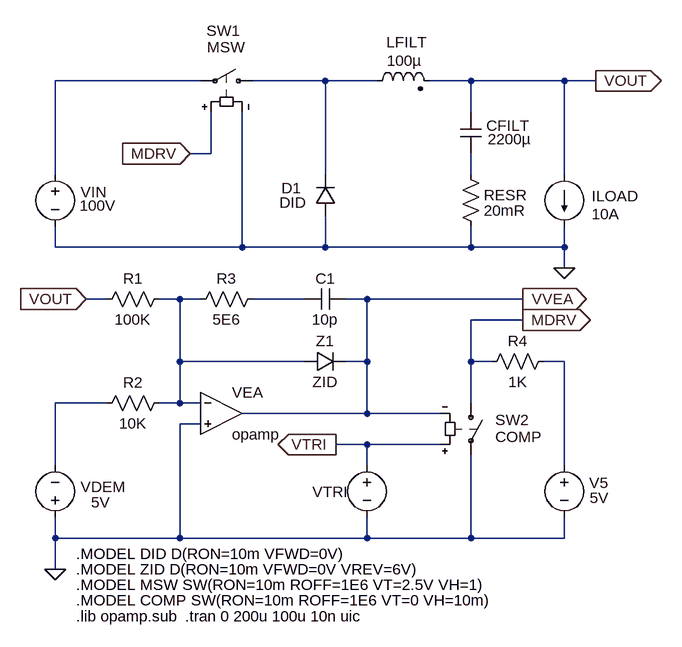
[diagram p0: schematic voltmodea[1].asc]
voltmodea[1].asc, the LTspice schematic file:
Version 4
SHEET 1 880 1136
WIRE -192 224 -416 224
WIRE 0 224 -112 224
WIRE 80 224 0 224
WIRE 224 224 160 224
WIRE 368 224 224 224
WIRE 416 224 368 224
WIRE 224 272 224 224
WIRE -176 336 -176 272
WIRE -176 336 -208 336
WIRE -416 368 -416 224
WIRE 0 368 0 224
WIRE 224 368 224 336
WIRE 368 368 368 224
WIRE -416 480 -416 448
WIRE -128 480 -128 272
WIRE -128 480 -416 480
WIRE 0 480 0 432
WIRE 0 480 -128 480
WIRE 224 480 224 448
WIRE 224 480 0 480
WIRE 368 480 368 448
WIRE 368 480 224 480
WIRE 368 512 368 480
WIRE -336 560 -368 560
WIRE -224 560 -256 560
WIRE -192 560 -224 560
WIRE -32 560 -112 560
WIRE 64 560 32 560
WIRE 304 560 64 560
WIRE 304 592 224 592
WIRE -224 656 -224 560
WIRE -32 656 -224 656
WIRE 64 656 64 560
WIRE 64 656 32 656
WIRE 224 656 224 592
WIRE 256 656 224 656
WIRE 368 656 336 656
WIRE -336 720 -416 720
WIRE -224 720 -224 656
WIRE -224 720 -256 720
WIRE -192 720 -224 720
WIRE 224 720 224 656
WIRE 64 736 64 656
WIRE 64 736 -128 736
WIRE 176 736 64 736
WIRE -192 752 -224 752
WIRE 64 784 16 784
WIRE 176 784 64 784
WIRE -416 816 -416 720
WIRE 64 816 64 784
WIRE 368 816 368 656
WIRE -416 928 -416 896
WIRE -224 928 -224 752
WIRE -224 928 -416 928
WIRE 64 928 64 896
WIRE 64 928 -224 928
WIRE 224 928 224 800
WIRE 224 928 64 928
WIRE 368 928 368 896
WIRE 368 928 224 928
WIRE -416 976 -416 928
FLAG -208 336 MDRV
IOPIN -208 336 In
FLAG 368 512 0
FLAG -368 560 VOUT
IOPIN -368 560 In
FLAG -416 976 0
FLAG 16 784 VTRI
IOPIN 16 784 Out
FLAG 304 592 MDRV
IOPIN 304 592 Out
FLAG 304 560 VVEA
IOPIN 304 560 Out
FLAG 416 224 VOUT
IOPIN 416 224 Out
SYMBOL ind2 64 240 R270
WINDOW 0 60 62 VTop 0
WINDOW 3 63 58 VBottom 0
SYMATTR InstName LFILT
SYMATTR Value 100µ
SYMATTR Type ind
SYMBOL diode 16 432 R180
WINDOW 0 53 43 Left 0
WINDOW 3 45 21 Left 0
SYMATTR InstName D1
SYMATTR Value DID
SYMBOL sw -96 224 M270
WINDOW 0 77 87 VLeft 0
WINDOW 3 52 86 VLeft 0
SYMATTR InstName SW1
SYMATTR Value MSW
SYMBOL voltage -416 352 R0
WINDOW 0 39 43 Left 0
WINDOW 3 38 64 Left 0
WINDOW 123 0 0 Left 0
WINDOW 39 0 0 Left 0
SYMATTR InstName VIN
SYMATTR Value 100V
SYMBOL Opamps\\opamp -160 672 R0
SYMATTR InstName VEA
SYMATTR SpiceLine2 GBW=400Meg
SYMBOL res -96 544 R90
WINDOW 0 0 56 VBottom 0
WINDOW 3 32 56 VTop 0
SYMATTR InstName R3
SYMATTR Value 5E6
SYMBOL cap 32 544 R90
WINDOW 0 0 32 VBottom 0
WINDOW 3 32 32 VTop 0
SYMATTR InstName C1
SYMATTR Value 10p
SYMBOL res -240 544 R90
WINDOW 0 0 56 VBottom 0
WINDOW 3 32 56 VTop 0
SYMATTR InstName R1
SYMATTR Value 100K
SYMBOL res -240 704 R90
WINDOW 0 0 56 VBottom 0
WINDOW 3 32 56 VTop 0
SYMATTR InstName R2
SYMATTR Value 10K
SYMBOL voltage -416 912 R180
WINDOW 0 -108 63 Left 0
WINDOW 3 -85 39 Left 0
WINDOW 123 0 0 Left 0
WINDOW 39 0 0 Left 0
SYMATTR InstName VDEM
SYMATTR Value 5V
SYMBOL sw 224 704 R0
WINDOW 0 38 42 Left 0
WINDOW 3 38 68 Left 0
SYMATTR InstName SW2
SYMATTR Value COMP
SYMBOL voltage 64 800 R0
WINDOW 0 -84 57 Left 0
WINDOW 3 -112 64 Invisible 0
WINDOW 123 0 0 Left 0
WINDOW 39 0 0 Left 0
SYMATTR InstName VTRI
SYMATTR Value PULSE(0 5 0 9.9u 1u 0 10u)
SYMBOL res 352 640 R90
WINDOW 0 0 56 VBottom 0
WINDOW 3 32 56 VTop 0
SYMATTR InstName R4
SYMATTR Value 1K
SYMBOL voltage 368 800 R0
WINDOW 0 38 43 Left 0
WINDOW 3 39 66 Left 0
WINDOW 123 0 0 Left 0
WINDOW 39 0 0 Left 0
SYMATTR InstName V5
SYMATTR Value 5V
SYMBOL diode -32 672 R270
WINDOW 0 32 32 VTop 0
WINDOW 3 0 32 VBottom 0
SYMATTR InstName Z1
SYMATTR Value ZID
SYMBOL cap 208 272 R0
WINDOW 0 40 21 Left 0
WINDOW 3 42 42 Left 0
SYMATTR InstName CFILT
SYMATTR Value 2200µ
SYMATTR SpiceLine IC=50V
SYMBOL res 208 352 R0
WINDOW 0 36 48 Left 0
WINDOW 3 36 72 Left 0
SYMATTR InstName RESR
SYMATTR Value 20mR
SYMBOL load2 368 368 R0
WINDOW 0 42 33 Left 0
WINDOW 3 42 61 Left 0
WINDOW 123 0 0 Left 0
WINDOW 39 0 0 Left 0
SYMATTR InstName ILOAD
SYMATTR Value 10A
TEXT -384 952 Left 0 !.MODEL DID D(RON=10m VFWD=0V)
TEXT -384 1000 Left 0 !.MODEL MSW SW(RON=10m ROFF=1E6 VT=2.5V VH=1)
TEXT -216 1048 Left 0 !.tran 0 200u 100u 10n uic
TEXT -384 1048 Left 0 !.lib opamp.sub
TEXT -384 1024 Left 0 !.MODEL COMP SW(RON=10m ROFF=1E6 VT=0 VH=10m)
TEXT -384 976 Left 0 !.MODEL ZID D(RON=10m VFWD=0V VREV=6V)

The netlist it stands for:
* voltmodea[1].asc
LFILT N002 VOUT 100µ
D1 0 N002 DID
SW1 N002 N001 MDRV 0 MSW
VIN N001 0 100V
XVEA N004 0 VVEA opamp Aol=100K GBW=400Meg  ; pins invin noninvin out
R3 N005 N004 5E6
C1 VVEA N005 10p
R1 N004 VOUT 100K
R2 N004 N007 10K
VDEM 0 N007 5V
SW2 MDRV 0 VTRI VVEA COMP
VTRI VTRI 0 PULSE(0 5 0 9.9u 1u 0 10u)
R4 N006 MDRV 1K
V5 N006 0 5V
D§Z1 N004 VVEA ZID
CFILT VOUT N003 2200µ IC=50V
RESR N003 0 20mR
ILOAD VOUT 0 10A
.model D D
.lib standard.dio
.MODEL DID D(RON=10m VFWD=0V)
.MODEL MSW SW(RON=10m ROFF=1E6 VT=2.5V VH=1)
.tran 0 200u 100u 10n uic
.lib opamp.sub
.MODEL COMP SW(RON=10m ROFF=1E6 VT=0 VH=10m)
.MODEL ZID D(RON=10m VFWD=0V VREV=6V)
.backanno
.end